# Altium schematic sheet CORE.SchDoc
size A4
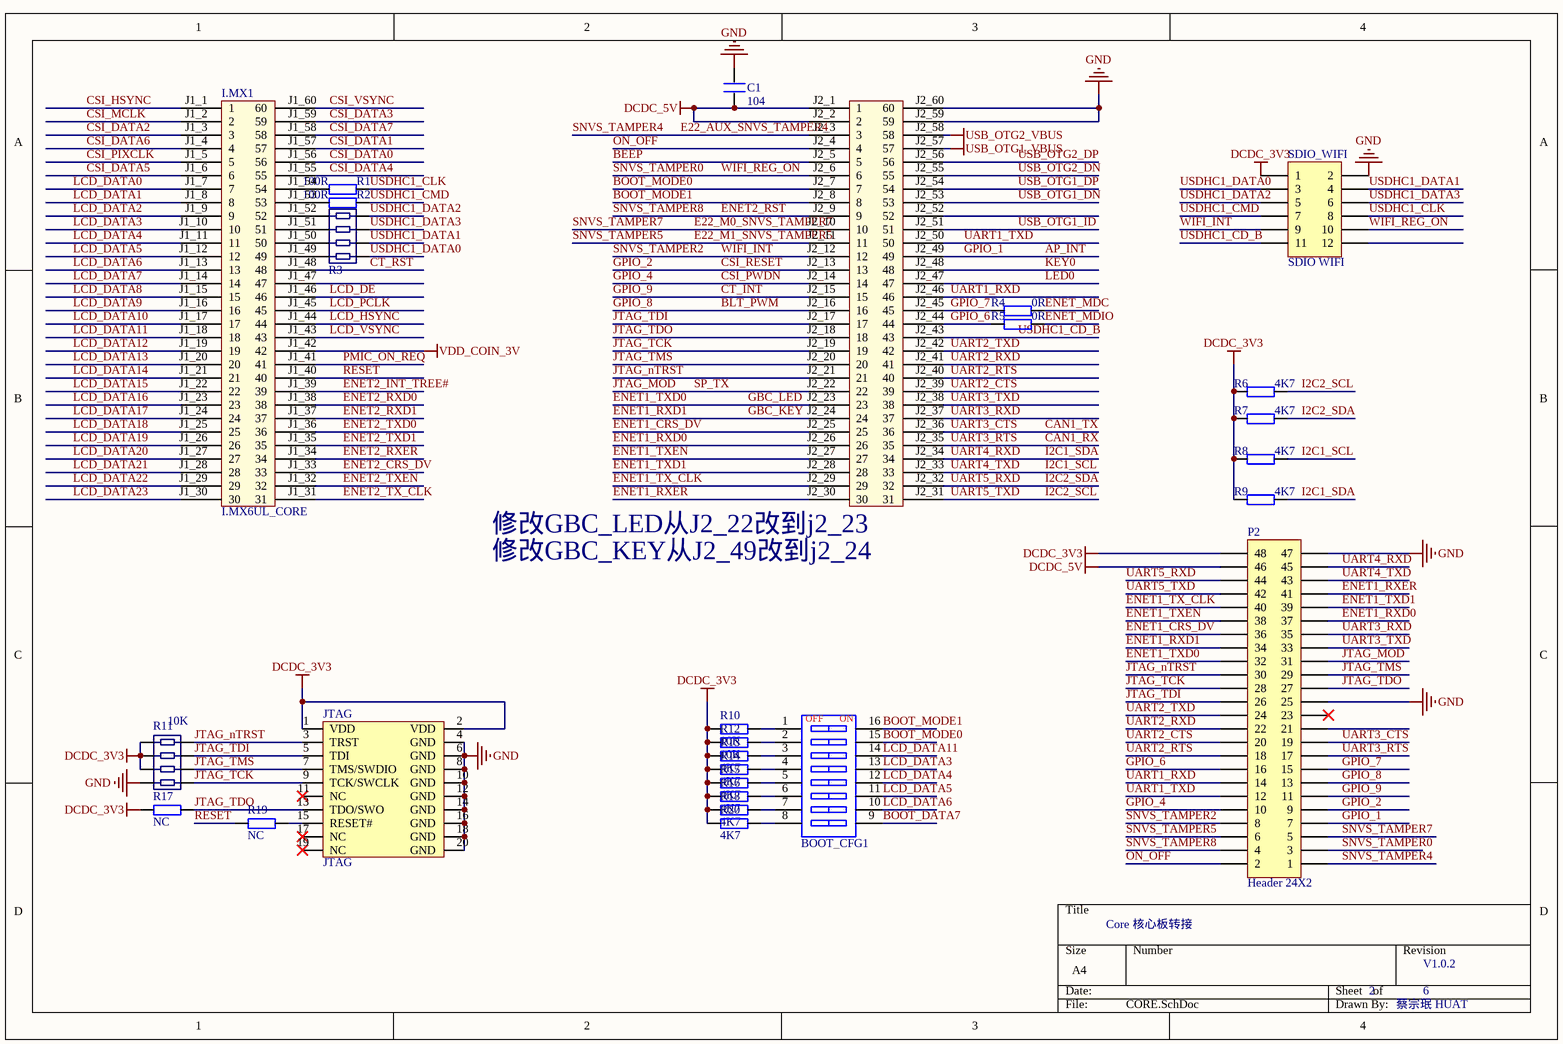
[diagram p0: CORE.SchDoc]

## Parts
BOOT_CFG1  CSW-8P  [CSW DIP-8P]  (value not drawn)
C1  104  [C_0603P]
I.MX1  I.MX6UL_CORE  [I.MX6UL_CORE]
JTAG  JTAG  [JTAG_20]
P2  Header 24X2  [HDR2X24]
R1  100R  [R_0603P]
R2  100R  [R_0603P]
R3  R*4_0603_2  [R*4-0603]  (value not drawn)
R4  0R  [R_0603P]
R5  0R  [R_0603P]
R6  4K7  [R_0603P]
R7  4K7  [R_0603P]
R8  4K7  [R_0603P]
R9  4K7  [R_0603P]
R10  10K  [R_0603P]
R11  10K  [R*4-0603]
R12  10K  [R_0603P]
R13  4K7  [R_0603P]
R14  4K7  [R_0603P]
R15  4K7  [R_0603P]
R16  4K7  [R_0603P]
R17  NC  [R_0603P]
R18  4K7  [R_0603P]
R19  NC  [R_0603P]
R20  4K7  [R_0603P]
SDIO_WIFI  SDIO WIFI  [HDR2X6]

## Nets
DCDC_3V3: JTAG.1(VDD) JTAG.2(VDD) P2.48 R6.1 R7.1 R8.1 R9.1 R10.1 R11.1 R11.3 R11.5 R12.1 R13.1 R14.1 R15.1 R16.1 R17.1 R18.1 R20.1 SDIO_WIFI.1
DCDC_5V: C1.1 I.MX1.J2_1(1) I.MX1.J2_2(2) P2.46
GND: C1.2 I.MX1.J2_59(59) I.MX1.J2_60(60) JTAG.4(GND) JTAG.6(GND) JTAG.8(GND) JTAG.10(GND) JTAG.12(GND) JTAG.14(GND) JTAG.16(GND) JTAG.18(GND) JTAG.20(GND) P2.25 P2.47 R11.7 SDIO_WIFI.2
USB_OTG1_VBUS: I.MX1.J2_57(57)
USB_OTG2_VBUS: I.MX1.J2_58(58)
VDD_COIN_3V: I.MX1.J1_42(42)
AP_INT: I.MX1.J2_49(49) P2.7  [also labelled GPIO_1]
BEEP: I.MX1.J2_5(5)
BLT_PWM: I.MX1.J2_16(16) P2.13  [also labelled GPIO_8]
BOOT_DATA7: BOOT_CFG1.9
BOOT_MODE0: BOOT_CFG1.15 I.MX1.J2_7(7)
BOOT_MODE1: BOOT_CFG1.16 I.MX1.J2_8(8)
CAN1_RX: I.MX1.J2_35(35) P2.17  [also labelled UART3_RTS]
CAN1_TX: I.MX1.J2_36(36) P2.19  [also labelled UART3_CTS]
CSI_DATA0: I.MX1.J1_56(56)
CSI_DATA1: I.MX1.J1_57(57)
CSI_DATA2: I.MX1.J1_3(3)
CSI_DATA3: I.MX1.J1_59(59)
CSI_DATA4: I.MX1.J1_55(55)
CSI_DATA5: I.MX1.J1_6(6)
CSI_DATA6: I.MX1.J1_4(4)
CSI_DATA7: I.MX1.J1_58(58)
CSI_HSYNC: I.MX1.J1_1(1)
CSI_MCLK: I.MX1.J1_2(2)
CSI_PIXCLK: I.MX1.J1_5(5)
CSI_PWDN: I.MX1.J2_14(14) P2.10  [also labelled GPIO_4]
CSI_RESET: I.MX1.J2_13(13) P2.9  [also labelled GPIO_2]
CSI_VSYNC: I.MX1.J1_60(60)
CT_INT: I.MX1.J2_15(15) P2.11  [also labelled GPIO_9]
CT_RST: I.MX1.J1_48(48)
E22_AUX_SNVS_TAMPER4: I.MX1.J2_3(3) P2.1  [also labelled SNVS_TAMPER4]
E22_M0_SNVS_TAMPER7: I.MX1.J2_10(10) P2.5  [also labelled SNVS_TAMPER7]
E22_M1_SNVS_TAMPER5: I.MX1.J2_11(11) P2.6  [also labelled SNVS_TAMPER5]
ENET1_CRS_DV: I.MX1.J2_25(25) P2.36
ENET1_RXD0: I.MX1.J2_26(26) P2.37
ENET1_RXD1: I.MX1.J2_24(24) P2.34  [also labelled GBC_KEY]
ENET1_RXER: I.MX1.J2_30(30) P2.41
ENET1_TX_CLK: I.MX1.J2_29(29) P2.40
ENET1_TXD0: I.MX1.J2_23(23) P2.32  [also labelled GBC_LED]
ENET1_TXD1: I.MX1.J2_28(28) P2.39
ENET1_TXEN: I.MX1.J2_27(27) P2.38
ENET2_CRS_DV: I.MX1.J1_33(33)
ENET2_INT_TREE#: I.MX1.J1_39(39)
ENET2_RST: I.MX1.J2_9(9) P2.4  [also labelled SNVS_TAMPER8]
ENET2_RXD0: I.MX1.J1_38(38)
ENET2_RXD1: I.MX1.J1_37(37)
ENET2_RXER: I.MX1.J1_34(34)
ENET2_TX_CLK: I.MX1.J1_31(31)
ENET2_TXD0: I.MX1.J1_36(36)
ENET2_TXD1: I.MX1.J1_35(35)
ENET2_TXEN: I.MX1.J1_32(32)
ENET_MDC: R4.2
ENET_MDIO: R5.2
GPIO_6: I.MX1.J2_44(44) P2.16 R5.1
GPIO_7: I.MX1.J2_45(45) P2.15 R4.1
I2C1_SCL: I.MX1.J2_33(33) P2.43 R8.2  [also labelled UART4_TXD]
I2C1_SDA: I.MX1.J2_34(34) P2.45 R9.2  [also labelled UART4_RXD]
I2C2_SCL: I.MX1.J2_31(31) P2.42 R6.2  [also labelled UART5_TXD]
I2C2_SDA: I.MX1.J2_32(32) P2.44 R7.2  [also labelled UART5_RXD]
JTAG_MOD: I.MX1.J2_22(22) P2.31  [also labelled SP_TX]
JTAG_nTRST: I.MX1.J2_21(21) JTAG.3(TRST) P2.30 R11.2
JTAG_TCK: I.MX1.J2_19(19) JTAG.9(TCK/SWCLK) P2.28 R11.8
JTAG_TDI: I.MX1.J2_17(17) JTAG.5(TDI) P2.26 R11.4
JTAG_TDO: I.MX1.J2_18(18) JTAG.13(TDO/SWO) P2.27 R17.2
JTAG_TMS: I.MX1.J2_20(20) JTAG.7(TMS/SWDIO) P2.29 R11.6
KEY0: I.MX1.J2_48(48)
LCD_DATA0: I.MX1.J1_7(7)
LCD_DATA1: I.MX1.J1_8(8)
LCD_DATA2: I.MX1.J1_9(9)
LCD_DATA3: BOOT_CFG1.13 I.MX1.J1_10(10)
LCD_DATA4: BOOT_CFG1.12 I.MX1.J1_11(11)
LCD_DATA5: BOOT_CFG1.11 I.MX1.J1_12(12)
LCD_DATA6: BOOT_CFG1.10 I.MX1.J1_13(13)
LCD_DATA7: I.MX1.J1_14(14)
LCD_DATA8: I.MX1.J1_15(15)
LCD_DATA9: I.MX1.J1_16(16)
LCD_DATA10: I.MX1.J1_17(17)
LCD_DATA11: BOOT_CFG1.14 I.MX1.J1_18(18)
LCD_DATA12: I.MX1.J1_19(19)
LCD_DATA13: I.MX1.J1_20(20)
LCD_DATA14: I.MX1.J1_21(21)
LCD_DATA15: I.MX1.J1_22(22)
LCD_DATA16: I.MX1.J1_23(23)
LCD_DATA17: I.MX1.J1_24(24)
LCD_DATA18: I.MX1.J1_25(25)
LCD_DATA19: I.MX1.J1_26(26)
LCD_DATA20: I.MX1.J1_27(27)
LCD_DATA21: I.MX1.J1_28(28)
LCD_DATA22: I.MX1.J1_29(29)
LCD_DATA23: I.MX1.J1_30(30)
LCD_DE: I.MX1.J1_46(46)
LCD_HSYNC: I.MX1.J1_44(44)
LCD_PCLK: I.MX1.J1_45(45)
LCD_VSYNC: I.MX1.J1_43(43)
LED0: I.MX1.J2_47(47)
ON_OFF: I.MX1.J2_4(4) P2.2
PMIC_ON_REQ: I.MX1.J1_41(41)
RESET: I.MX1.J1_40(40) R19.1
SNVS_TAMPER0: I.MX1.J2_6(6) P2.3 SDIO_WIFI.10  [also labelled WIFI_REG_ON]
SNVS_TAMPER2: I.MX1.J2_12(12) P2.8 SDIO_WIFI.9  [also labelled WIFI_INT]
UART1_RXD: I.MX1.J2_46(46) P2.14
UART1_TXD: I.MX1.J2_50(50) P2.12
UART2_CTS: I.MX1.J2_39(39) P2.20
UART2_RTS: I.MX1.J2_40(40) P2.18
UART2_RXD: I.MX1.J2_41(41) P2.22
UART2_TXD: I.MX1.J2_42(42) P2.24
UART3_RXD: I.MX1.J2_37(37) P2.35
UART3_TXD: I.MX1.J2_38(38) P2.33
USB_OTG1_DN: I.MX1.J2_53(53)
USB_OTG1_DP: I.MX1.J2_54(54)
USB_OTG1_ID: I.MX1.J2_51(51)
USB_OTG2_DN: I.MX1.J2_55(55)
USB_OTG2_DP: I.MX1.J2_56(56)
USDHC1_CD_B: I.MX1.J2_43(43) SDIO_WIFI.11
USDHC1_CLK: R1.2 SDIO_WIFI.8
USDHC1_CMD: R2.2 SDIO_WIFI.7
USDHC1_DATA0: R3.8 SDIO_WIFI.3
USDHC1_DATA1: R3.6 SDIO_WIFI.4
USDHC1_DATA2: R3.2 SDIO_WIFI.5
USDHC1_DATA3: R3.4 SDIO_WIFI.6
NetBOOT_CFG1_1: BOOT_CFG1.1 R10.2
NetBOOT_CFG1_2: BOOT_CFG1.2 R12.2
NetBOOT_CFG1_3: BOOT_CFG1.3 R13.2
NetBOOT_CFG1_4: BOOT_CFG1.4 R14.2
NetBOOT_CFG1_5: BOOT_CFG1.5 R15.2
NetBOOT_CFG1_6: BOOT_CFG1.6 R16.2
NetBOOT_CFG1_7: BOOT_CFG1.7 R18.2
NetBOOT_CFG1_8: BOOT_CFG1.8 R20.2
NetI.MX1_J1_49: I.MX1.J1_49(49) R3.7
NetI.MX1_J1_50: I.MX1.J1_50(50) R3.5
NetI.MX1_J1_51: I.MX1.J1_51(51) R3.3
NetI.MX1_J1_52: I.MX1.J1_52(52) R3.1
NetI.MX1_J1_53: I.MX1.J1_53(53) R2.1
NetI.MX1_J1_54: I.MX1.J1_54(54) R1.1
NetJTAG_15: JTAG.15(RESET#) R19.2

Not connected (* = marked no-connect by the designer): I.MX1 J1_47(47) J2_52(52); JTAG 11(NC)* 17(NC)* 19(NC)*; P2 21 23*; SDIO_WIFI 12

## Notes on the sheet
- (near I.MX1) 修改GBC_LED从J2_22改到j2_23
- (near I.MX1) 修改GBC_KEY从J2_49改到j2_24
- Core 核心板转接
- 2
- 6
- V1.0.2
- 蔡宗珉 HUAT
- (in symbol CSW-8P) OFF; ON

## Library data of the parts
BOOT_CFG1 = CSW-8P: 8路编码开关; 版权归属: 源创客; BOM名称: 8路编码开关; 学习资源: www.ooocke.com
C1 = C
I.MX1 = I.MX6UL核心板
P2 = Header 24X2: Header, 24-Pin, Dual row; LatestRevisionDate: 17-Jul-2002; LatestRevisionNote: Re-released for DXP Platform.; Publisher: Altium Limited
R1 R2 R4-R10 R12-R20 = R
R11 = R*4_0603_2
SDIO_WIFI = Header 6X2: Header, 6-Pin, Dual row; LatestRevisionDate: 17-Jul-2002; LatestRevisionNote: Re-released for DXP Platform.; Publisher: Altium Limited